# EasyEDA Pro project nrf52840_test_board.epro

# Schematic nrf52840_test_board
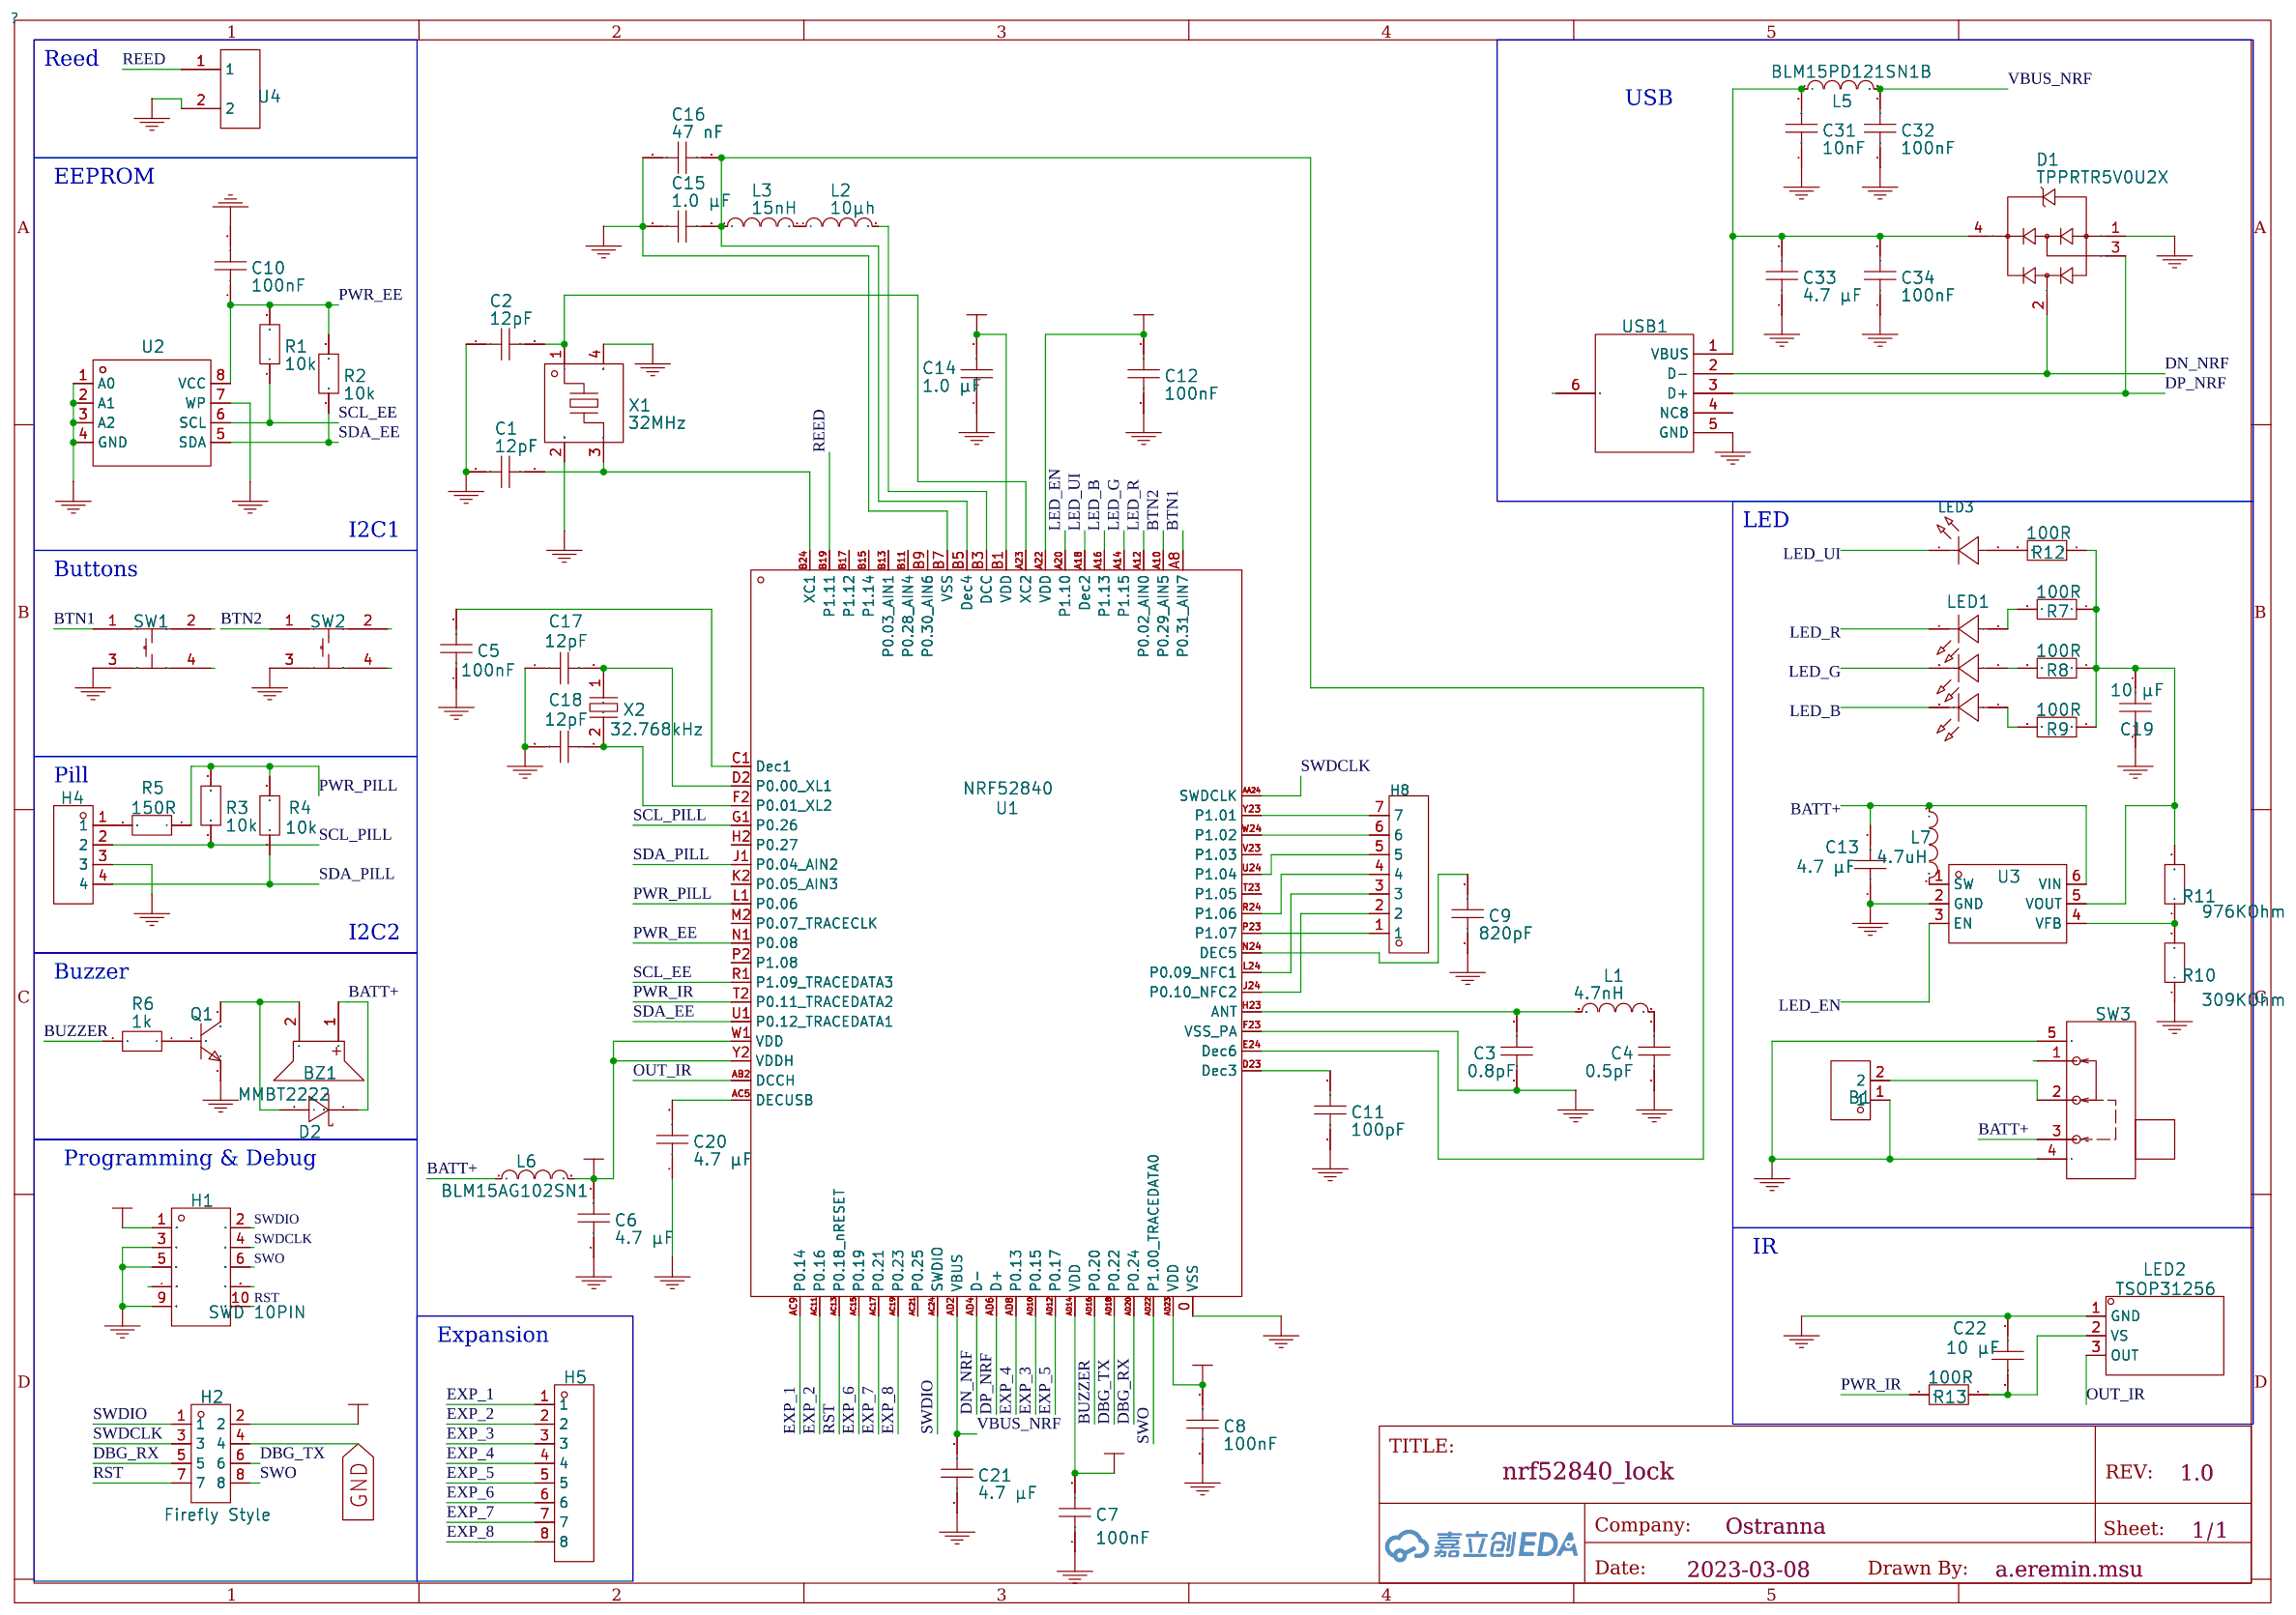
[diagram p0: schematic sheet]

## Parts
B1  MF200V-11-02P  [BAT-TH_2P-P14.50_2462]  (no BOM)
BZ1  QMB-09B-03  [BUZ-TH_BD9.0-P4.00-D0.6-FD]
C1  12pF  [C0402]
C2  12pF  [C0402]
C3  0.8pF  [C0402]
C4  0.5pF  [C0402]
C5  100nF  [C0402]
C6  4.7 µF  [C0603]
C7  100nF  [C0402]
C8  100nF  [C0402]
C9  820pF  [C0402]
C10  100nF  [C0402]
C11  100pF  [C0402]
C12  100nF  [C0402]
C13  4.7 µF  [C0603]
C14  1.0 µF  [C0603]
C15  1.0 µF  [C0603]
C16  47 nF  [C0402]
C17  12pF  [C0402]
C18  12pF  [C0402]
C19  10 µF  [C0603]
C20  4.7 µF  [C0603]
C21  4.7 µF  [C0603]
C22  10 µF  [C0603]
C31  10nF  [C0402]
C32  100nF  [C0402]
C33  4.7 µF  [C0603]
C34  100nF  [C0402]
D1  TPPRTR5V0U2X  [SOT-143_L2.9-W1.3-P1.92-LS2.3-BR]
D2  BAT54WS_C397611  [SOD-323_L1.8-W1.3-LS2.5-RD]
H1  SWD 10PIN  [HDR-SMD_10P-P1.27-V-M-R2-C5-LS5.5]
H2  Firefly Style  [HDR-TH_8P-P2.54-V-M-R2-C4-S2.54]
H4  DW254W-11-04-85  [HDR-TH_4P-P2.54-H-F-W10.3-N]
H5  DW254W-11-08-85  [HDR-TH_8P-P2.54-H-F-W10.3-N]
H8  PZ254R-11-07P  [HDR-TH_7P-P2.54-H-M-W10.4]
L1  4.7nH  [C0402]
L2  10µh  [L0603]
L3  15nH  [C0402]
L5  BLM15PD121SN1B  [L0402]
L6  BLM15AG102SN1  [L0402]
L7  4.7uH  [L0603]
LED1  TC5050RGBF08-3CJH-AF53A  [LED-SMD_6P-L5.0-W5.0-TL_TC5050RGBF08]
LED2  TSOP31256  [SENSOR-TH_TSOP31256]
LED3  LTST-T680TGWT  [LED-SMD_L3.2-W2.8-LS3.5-RD_GREEN]
Q1  MMBT2222  [SOT-23-3_L2.9-W1.4-P1.91-LS2.6-BR]
R1  10k  [R0603]
R2  10k  [R0603]
R3  10k  [R0603]
R4  10k  [R0603]
R5  150R  [R0603]
R6  1k  [R0603]
R7  100R  [R0603]
R8  100R  [R0603]
R9  100R  [R0603]
R10  309KOhm  [R0603]
R11  976KOhm  [R0603]
R12  100R  [R0603]
R13  100R  [R0603]
SW1  TS-1187A-C-D-B  [KEY-SMD_4P-L5.2-W5.2-P3.7-LS6.4-TL]
SW2  TS-1187A-C-D-B  [KEY-SMD_4P-L5.2-W5.2-P3.7-LS6.4-TL]
SW3  SS-12F44-G5_C2998807  [SW-TH_SS-12F44-G5_C2998807]
U1  NRF52840  [AQFN-73_L7.0-W7.0-P0.50-BL-EP4.8-REDUCE-PAD]
U2  BL24C256A-SFRC  [TSSOP-8_L4.4-W3.0-P0.65-LS6.4-BL]
U3  MCP1640CT-I/CHY  [SOT-23-6_L2.9-W1.6-P0.95-LS2.8-BR]
U4  59165-1-S-00-D  [SENSOR-SMD_59165-1-S-00-D]
USB1  U254-051T-4BH83-S1S  [MICRO-USB-SMD_U254-051T-4BH83-S1S]
X1  32MHz  [CRYSTAL-SMD_4P-L2.0-W1.6-BL]
X2  32.768kHz  [CRYSTAL-SMD_L3.2-W1.5]

## Library data of the parts
B1 = MF200V-11-02P: link: https://atta.szlcsc.com/upload/public/pdf/source/20200414/C501331_15EF5154D14F95062AC11A8719FD61A3.pdf; 3DModel: HDR-TH_2P-P2.00-V-F-3; Supplier: LCSC; Supplier Part: C501331; Manufacturer: XFCN(兴飞); JLCPCB Part Class: Extended Part
BZ1 = QMB-09B-03: link: https://item.szlcsc.com/173200.html; 3DModel: BUZ-TH_D9.0-H5.5-P4.0; Supplier: LCSC; Manufacturer: 华能; Supplier Part: C96256; JLCPCB Part Class: Extended Part; Frequency: 2700Hz
C1 C2 C17 C18 = 12pF: link: https://item.szlcsc.com/15869.html; 3DModel: C0402_L1.0-W0.5-H0.5; Supplier Part: C1547; Supplier: LCSC; Manufacturer Part: 0402CG120J500NT; Manufacturer: FH(风华)
C3 = 0.8pF: link: https://item.szlcsc.com/15869.html; 3DModel: C0402_L1.0-W0.5-H0.5; Supplier Part: C88902; Supplier: LCSC; Manufacturer Part: GJM1555C1HR80WB01D; Manufacturer: muRata(村田)
C4 = 0.5pF: link: https://item.szlcsc.com/15869.html; 3DModel: C0402_L1.0-W0.5-H0.5; Supplier Part: C285052; Supplier: LCSC; Manufacturer Part: 0402CG0R5B500NT; Manufacturer: FH(风华)
C5 C7 C8 C10 C12 C32 C34 = 100nF: link: https://item.szlcsc.com/15869.html; 3DModel: C0402_L1.0-W0.5-H0.5; Supplier Part: C71629; Supplier: LCSC; Manufacturer Part: GRM155R71C104KA88D; Manufacturer: muRata(村田)
C6 C13 C20 C21 C33 = 4.7 µF: link: https://item.szlcsc.com/362304.html; 3DModel: C0603_L1.6-W0.8-H0.8; Supplier Part: C71631; Supplier: LCSC; Manufacturer Part: GRM188R60J475KE19D; Manufacturer: muRata(村田)
C9 = 820pF: link: https://item.szlcsc.com/15869.html; 3DModel: C0402_L1.0-W0.5-H0.5; Supplier Part: C161159; Supplier: LCSC; Manufacturer Part: GCM1555C1H821JA16D; Manufacturer: muRata(村田)
C11 = 100pF: link: https://item.szlcsc.com/15869.html; 3DModel: C0402_L1.0-W0.5-H0.5; Supplier Part: C126492; Supplier: LCSC; Manufacturer Part: GCM1555C1H101JA16D; Manufacturer: muRata(村田)
C14 C15 = 1.0 µF: link: https://item.szlcsc.com/362304.html; 3DModel: C0603_L1.6-W0.8-H0.8; Supplier Part: C15849; Supplier: LCSC; Manufacturer Part: CL10A105KB8NNNC; Manufacturer: SAMSUNG(三星)
C16 = 47 nF: link: https://item.szlcsc.com/15869.html; 3DModel: C0402_L1.0-W0.5-H0.5; Supplier Part: C314287; Supplier: LCSC; Manufacturer Part: 0402B473K250CT; Manufacturer: Walsin(华新科)
C19 C22 = 10 µF: link: https://item.szlcsc.com/362304.html; 3DModel: C0603_L1.6-W0.8-H0.8; Supplier Part: C15849; Supplier: LCSC; Manufacturer Part: CL10A105KB8NNNC; Manufacturer: SAMSUNG(三星)
C31 = 10nF: link: https://item.szlcsc.com/15869.html; 3DModel: C0402_L1.0-W0.5-H0.5; Supplier Part: C2894320; Supplier: LCSC; Manufacturer Part: 0402B103J160NT; Manufacturer: FH(风华)
D1 = TPPRTR5V0U2X: link: https://item.szlcsc.com/280548.html; 3DModel: SOT-143-4P_L3.0-W1.3-H1.0-LS2.3-P1.70; Supplier: LCSC; Supplier Part: C558444; Manufacturer: TECH PUBLIC(台舟); JLCPCB Part Class: Extended Part
D2 = BAT54WS_C397611: link: https://item.szlcsc.com/295156.html; 3DModel: SOD-323_L1.7-W1.3-H1.1-LS2.5; Supplier: LCSC; Supplier Part: C397611; Manufacturer: AnBon(安邦); Manufacturer Part: BAT54WS; JLCPCB Part Class: Extended Part
H1 = SWD 10PIN: link: https://atta.szlcsc.com/upload/public/pdf/source/20220712/F0350B34ECC1B54ABD62D9C7F0276F32.pdf; Supplier: LCSC; Supplier Part: C4943297; Manufacturer: kinghelm(金航标); Manufacturer Part: KH-1.27PH180-2X5P-L7.2-SMT; JLCPCB Part Class: Extended Part
H2 = Firefly Style: link: https://item.szlcsc.com/502977.html; 3DModel: HDR-TH_8P-P2.54-M-LI-2X4P; Supplier: LCSC; Supplier Part: C2935919; Manufacturer: DEALON(德艺隆); Manufacturer Part: DZ254R-22-08-63; JLCPCB Part Class: Extended Part
H4 = DW254W-11-04-85: link: https://atta.szlcsc.com/upload/public/pdf/source/20211231/3C4D2E6B78ED2773EE45870C43BA2BC5.pdf; Supplier: LCSC; Supplier Part: C2935994; Manufacturer: DEALON(德艺隆); JLCPCB Part Class: Extended Part
H5 = DW254W-11-08-85: link: https://atta.szlcsc.com/upload/public/pdf/source/20211231/3C4D2E6B78ED2773EE45870C43BA2BC5.pdf; Supplier: LCSC; Supplier Part: C2935998; Manufacturer: DEALON(德艺隆); JLCPCB Part Class: Extended Part
H8 = PZ254R-11-07P: Number of Rows:单排 Number of Pins:7 Pitch:2.54mm Pin Structure:1x7P Row Spacing:- Mounting Type:Shrouded Circluar Pins/Square Pins:Square Pins Current Rating (Max):- Voltage Rating (Max):- Length of Mating Pin:6mm Insulation Height:2.5mm Contact Material:; LCSC Part Name: 2.54mm 1x7P 弯插 方针; Supplier Part: C492415; Manufacturer: XFCN(兴飞); Supplier Footprint: 弯插,P=2.54mm; JLCPCB Part Class: Extended Part; Datasheet: https://atta.szlcsc.com/upload/public/pdf/source/20200309/C492415_DA188E9910EB3F381D5A5032EE25D5A2.pdf; Supplier: LCSC; Number of Rows: 单排; Number of Pins: 7; Pitch: 2.54mm; Pin Structure: 1x7P; Mounting Type: Shrouded; Circluar Pins/Square Pins: Square Pins; Length of Mating Pin: 6mm; Insulation Height: 2.5mm; Operating Temperature Range: -40℃~+105℃; Color: Black
L1 = 4.7nH: link: https://item.szlcsc.com/15869.html; 3DModel: C0402_L1.0-W0.5-H0.5; Supplier Part: C23769; Supplier: LCSC; Manufacturer Part: LQP15MN4N7B02D; Manufacturer: muRata(村田)
L2 = 10µh: link: https://item.szlcsc.com/344093.html; 3DModel: L0603_L1.6-W0.8-H0.5_BEAD; Supplier Part: C87216; Supplier: LCSC; Manufacturer Part: LBMF1608T100K; Manufacturer: TAIYO YUDEN(太诱)
L3 = 15nH: link: https://item.szlcsc.com/15869.html; 3DModel: C0402_L1.0-W0.5-H0.5; Supplier Part: C329619; Supplier: LCSC; Manufacturer Part: CS0402-15NH-S; Manufacturer: chilisin(奇力新)
L5 = BLM15PD121SN1B: link: https://item.szlcsc.com/344049.html; 3DModel: L0402_L1.0-W0.5-H0.5_BEAD; Supplier: LCSC; Supplier Part: C76891; Manufacturer: muRata(村田); Manufacturer Part: BLM15PD121SN1D
L6 = BLM15AG102SN1: link: https://item.szlcsc.com/344049.html; 3DModel: L0402_L1.0-W0.5-H0.5_BEAD; Supplier: LCSC; Manufacturer: muRata(村田); Manufacturer Part: BLM15AG102SN1D; Supplier Part: C76883; JLCPCB Part Class: Extended Part
L7 = 4.7uH: link: https://item.szlcsc.com/344093.html; 3DModel: L0603_L1.6-W0.8-H0.5_BEAD; Supplier Part: C295681; Supplier: LCSC; Manufacturer Part: CPY160808T-4R7M-NP; Manufacturer: chilisin(奇力新)
LED1 = TC5050RGBF08-3CJH-AF53A: link: https://item.szlcsc.com/839886.html; Supplier: LCSC; Supplier Part: C784540; Manufacturer: TCWIN(天成); JLCPCB Part Class: Extended Part
LED2 = TSOP31256: Supplier: LCSC; Supplier Part: C222500; Manufacturer: VISHAY(威世); JLCPCB Part Class: Extended Part
LED3 = LTST-T680TGWT: Emitted Color:普绿/Yellow-Green Diode Configuration:- Lens Color:- Dominant Wavelength:520nm~535nm Dominant Wavelength:520nm~535nm Peak Wavelength:523nm Color Temperature:- Color Temperature:- Forward Current:20mA Power Dissipation:80mW Viewing Angle:120° M; LCSC Part Name: 普绿/黄绿 520nm~535nm; Supplier Part: C575517; Manufacturer: LITEON(光宝); Supplier Footprint: 3528(mm); JLCPCB Part Class: Extended Part; Datasheet: https://atta.szlcsc.com/upload/public/pdf/source/20200604/C575517_740B39B6E37E2B158EE3A100F537416B.pdf; Supplier: LCSC; Emitted Color: 普绿/Yellow-Green; Dominant Wavelength: 520nm~535nm; Peak Wavelength: 523nm; Forward Current: 20mA; Power Dissipation: 80mW; Viewing Angle: 120°; Operating Temperature: -40℃~+85℃
Q1 = MMBT2222: link: https://atta.szlcsc.com/upload/public/pdf/source/20210506/C2828457_40A6ADD2242555ADA7F9DD1BF18610A6.pdf; Supplier: LCSC; Supplier Part: C2891810; Manufacturer: YONGYUTAI(永裕泰); JLCPCB Part Class: Extended Part
R1-R4 = 10k: link: https://www.mouser.in/datasheet/2/447/PYu_RT_1_to_0_01_RoHS_L_11-1669912.pdf; Supplier Part: C25804; Supplier: LCSC; Manufacturer Part: 0603WAF1002T5E; Manufacturer: UNI-ROYAL(厚声)
R5 = 150R: link: https://www.mouser.in/datasheet/2/447/PYu_RT_1_to_0_01_RoHS_L_11-1669912.pdf; Supplier Part: C22808; Supplier: LCSC; Manufacturer Part: 0603WAF1500T5E; Manufacturer: UNI-ROYAL(厚声)
R6 = 1k: link: https://www.mouser.in/datasheet/2/447/PYu_RT_1_to_0_01_RoHS_L_11-1669912.pdf; Supplier Part: C21190; Supplier: LCSC; Manufacturer Part: 0603WAF1001T5E; Manufacturer: UNI-ROYAL(厚声)
R7-R9 R12 R13 = 100R: link: https://www.mouser.in/datasheet/2/447/PYu_RT_1_to_0_01_RoHS_L_11-1669912.pdf; Supplier Part: C22775; Supplier: LCSC; Manufacturer Part: 0603WAF1000T5E; Manufacturer: UNI-ROYAL(厚声)
R10 = 309KOhm: link: https://www.mouser.in/datasheet/2/447/PYu_RT_1_to_0_01_RoHS_L_11-1669912.pdf; Supplier Part: C23001; Supplier: LCSC; Manufacturer Part: 0603WAF3093T5E; Manufacturer: UNI-ROYAL(厚声)
R11 = 976KOhm: link: https://www.mouser.in/datasheet/2/447/PYu_RT_1_to_0_01_RoHS_L_11-1669912.pdf; Supplier Part: C177960; Supplier: LCSC; Manufacturer Part: RCT03976KFLF; Manufacturer: HKR
SW1 SW2 = TS-1187A-C-D-B: link: https://item.szlcsc.com/512193.html?ref=editor&logined=true; Supplier: LCSC; Supplier Part: C318888; Manufacturer: XKB Connectivity(中国星坤); JLCPCB Part Class: Extended Part
SW3 = SS-12F44-G5_C2998807: link: https://atta.szlcsc.com/upload/public/pdf/source/20220428/590A0165C728230C4E39516860AD3726.pdf; Supplier: LCSC; Supplier Part: C2998807; Manufacturer: DEALON(德艺隆); Manufacturer Part: SS-12F44-G5; JLCPCB Part Class: Extended Part
U1 = NRF52840: 3DModel: AQFN-73_L7.0-W7.0-H0.9-P0.50; link: https://so.szlcsc.com/global.html?c=&k=C190794; Manufacturer Part: NRF52840-QIAA-R; Supplier: LCSC; Supplier Part: C190794; Manufacturer: NORDIC
U2 = BL24C256A-SFRC: link: https://item.szlcsc.com/42180.html; 3DModel: TSSOP-8_L3.0-W4.4-H1.0-LS6.4-P0.65; Supplier: LCSC; Manufacturer: BL(上海贝岭); Supplier Part: C110276; JLCPCB Part Class: Extended Part
U3 = MCP1640CT-I/CHY: link: https://item.szlcsc.com/169042.html; 3DModel: SOT-23-6_L2.9-W1.6-H1.5-LS2.8-P0.95; Supplier: LCSC; Supplier Part: C511326; Manufacturer: MICROCHIP(美国微芯); JLCPCB Part Class: Extended Part
U4 = 59165-1-S-00-D: link: https://item.szlcsc.com/763200.html; 3DModel: SENSOR-SMD_L16-W2.4-H2.4-59165-1-S-00-D; Supplier: LCSC; Supplier Part: C720178; Manufacturer: Littelfuse(美国力特); JLCPCB Part Class: Extended Part
USB1 = U254-051T-4BH83-S1S: link: https://item.szlcsc.com/300252.html; Supplier: LCSC; Supplier Part: C319160; Manufacturer: XKB Connectivity(中国星坤); JLCPCB Part Class: Extended Part
X1 = 32MHz: link: https://item.szlcsc.com/248817.html; 3DModel: OSC-SMD_4P-L2.0-W1.6-H0.8; Supplier: LCSC; Supplier Part: C2901738; Manufacturer: SCTF(星通时频); Manufacturer Part: SX1B32.000F0810F30; JLCPCB Part Class: Extended Part
X2 = 32.768kHz: link: https://atta.szlcsc.com/upload/public/pdf/source/20171201/C156245_15121213439061157573.pdf; 3DModel: CRYSTAL-SMD_L3.2-W1.5-1; Supplier: LCSC; Supplier Part: C841881; Manufacturer: EPSON(爱普生); Manufacturer Part: Q13FC13500005; JLCPCB Part Class: Extended Part

## Nets
GND: B1.1 C1.2 C2.1 C3.2 C4.2 C5.1 C6.1 C7.1 C8.1 C9.1 C10.2 C11.1 C12.1 C13.1 C14.1 C15.2 C16.2 C17.1 C18.2 C19.2 C20.1 C21.1 C22.1 C31.1 C32.1 C33.1 C34.1 D1.1 H1.3(0) H1.5(0) H1.9(0) H2.4 H4.3 LED2.1(GND) Q1.2(E) R10.1 SW1.3 SW2.3 SW3.4 SW3.5 U1.0(VSS) U1.B7(VSS) U1.F23(VSS_PA) U2.1(A0) U2.2(A1) U2.3(A2) U2.4(GND) U2.7(WP) U3.2(GND) U4.2 USB1.5(GND) X1.2(GND) X1.4(GND)
VBUS_NRF: C21.2 C32.2 L5.2 U1.AD2(VBUS)
VCC: C6.2 C7.2 C8.2 C12.2 C14.2 H1.1(VCC) H2.2 L6.2 U1.A22(VDD) U1.AD14(VDD) U1.AD23(VDD) U1.B1(VDD) U1.W1(VDD) U1.Y2(VDDH)
BATT+: BZ1.1 C13.2 D2.1(C) L6.1 L7.1 SW3.3 U3.6(VIN)
BTN1: SW1.1 U1.A8(P0.31_AIN7)
BTN2: SW2.1 U1.A10(P0.29_AIN5)
BUZZER: R6.2 U1.AD16(P0.20)
DBG_RX: H2.5 U1.AD20(P0.24)
DBG_TX: H2.6 U1.AD18(P0.22)
DN_NRF: D1.2 U1.AD4(D-) USB1.2(D-)
DP_NRF: D1.3 U1.AD6(D+) USB1.3(D+)
EH: USB1.6(EH)
EXP_1: H5.1 U1.AC9(P0.14)
EXP_2: H5.2 U1.AC11(P0.16)
EXP_3: H5.3 U1.AD10(P0.15)
EXP_4: H5.4 U1.AD8(P0.13)
EXP_5: H5.5 U1.AD12(P0.17)
EXP_6: H5.6 U1.AC15(P0.19)
EXP_7: H5.7 U1.AC17(P0.21)
EXP_8: H5.8 U1.AC19(P0.23)
LED_B: LED1.6(-) U1.A16(P1.13)
LED_EN: U1.A20(P1.10) U3.3(EN)
LED_G: LED1.5(-) U1.A14(P1.15)
LED_R: LED1.4(-) U1.A12(P0.02_AIN0)
LED_UI: LED3.1(-) U1.A18(Dec2)
NC1: H1.8(NC1)
NC2: H1.7(NC2)
NC3: SW1.2(NC3)
NC4: SW1.4(NC4)
NC5: SW2.4(NC5)
NC6: SW2.2(NC6)
NC7: SW3.1(NC7)
OUT_IR: LED2.3(OUT) U1.AB2(DCCH)
PWR_EE: C10.1 R1.2 R2.2 U1.N1(P0.08) U2.8(VCC)
PWR_IR: R13.2 U1.T2(P0.11_TRACEDATA2)
PWR_PILL: R3.2 R4.2 R5.1 U1.L1(P0.06)
REED: U1.B19(P1.11) U4.1
RST: H1.10(RST) H2.7 U1.AC13(P0.18_nRESET)
SCL_EE: R1.1 U1.R1(P1.09_TRACEDATA3) U2.6(SCL)
SCL_PILL: H4.2 R3.1 U1.G1(P0.26)
SDA_EE: R2.1 U1.U1(P0.12_TRACEDATA1) U2.5(SDA)
SDA_PILL: H4.4 R4.1 U1.J1(P0.04_AIN2)
SWDCLK: H1.4(CLK) H2.3 U1.AA24(SWDCLK)
SWDIO: H1.2(IO) H2.1 U1.AC24(SWDIO)
SWO: H1.6(SWO) H2.8 U1.AD22(P1.00_TRACEDATA0)
$1N227: C1.1 U1.B24(XC1) X1.3
$1N363: C20.2 U1.AC5(DECUSB)
$1N366: C11.2 U1.D23(Dec3)
$1N371: C2.2 U1.A23(XC2) X1.1
$1N374: C3.1 L1.2 U1.H23(ANT)
$1N375: L2.2 U1.B3(DCC)
$1N434: C9.2 U1.N24(DEC5)
$1N435: H8.7 U1.Y23(P1.01)
$1N436: H8.6 U1.W24(P1.02)
$1N437: H8.1 U1.P23(P1.07)
$1N512: C31.2 C33.2 C34.2 D1.4 L5.1 USB1.1(VBUS)
$1N553: C15.1 C16.1 L3.1 U1.B5(Dec4) U1.E24(Dec6)
$1N611: C5.2 U1.C1(Dec1)
$1N612: C17.2 U1.D2(P0.00_XL1) X2.1
$1N613: C18.1 U1.F2(P0.01_XL2) X2.2(GND)
$1N771: BZ1.2 D2.2(A) Q1.3(C)
$1N826: C19.1 R7.1 R8.1 R9.1 R11.2 R12.1 U3.5(VOUT)
$1N837: LED1.3(+) R7.2
$1N838: LED1.2(+) R8.2
$1N839: LED1.1(+) R9.2
$1N906: R10.2 R11.1 U3.4(VFB)
$1N953: B1.2 SW3.2
$1N1077: H8.2 U1.J24(P0.10_NFC2)
$1N1078: H8.3 U1.L24(P0.09_NFC1)
$1N1079: H8.4 U1.R24(P1.06)
$1N1080: H8.5 U1.U24(P1.04)
$1N1121: C22.2 LED2.2(VS) R13.1
$1N1128: L2.1 L3.2
$1N1133: C4.1 L1.1
$1N1160: H4.1 R5.2
$1N1161: Q1.1(B) R6.1
$1N1164: L7.2 U3.1(SW)
$1N4867: LED3.2(+) R12.2

Not connected (* = marked no-connect by the designer): U1 AC21(P0.25) B9(P0.30_AIN6) B11(P0.28_AIN4) B13(P0.03_AIN1) B15(P1.14) B17(P1.12) H2(P0.27) K2(P0.05_AIN3) M2(P0.07_TRACECLK) P2(P1.08) T23(P1.05) V23(P1.03); USB1 4(NC8)

## Notes on the sheet
- Reed
- USB
- EEPROM
- LED
- I2C1
- Buttons
- Pill
- I2C2
- Buzzer
- Programming & Debug
- IR
- Expansion

# Board 1-PCB_PCB_nrf52840_test_board
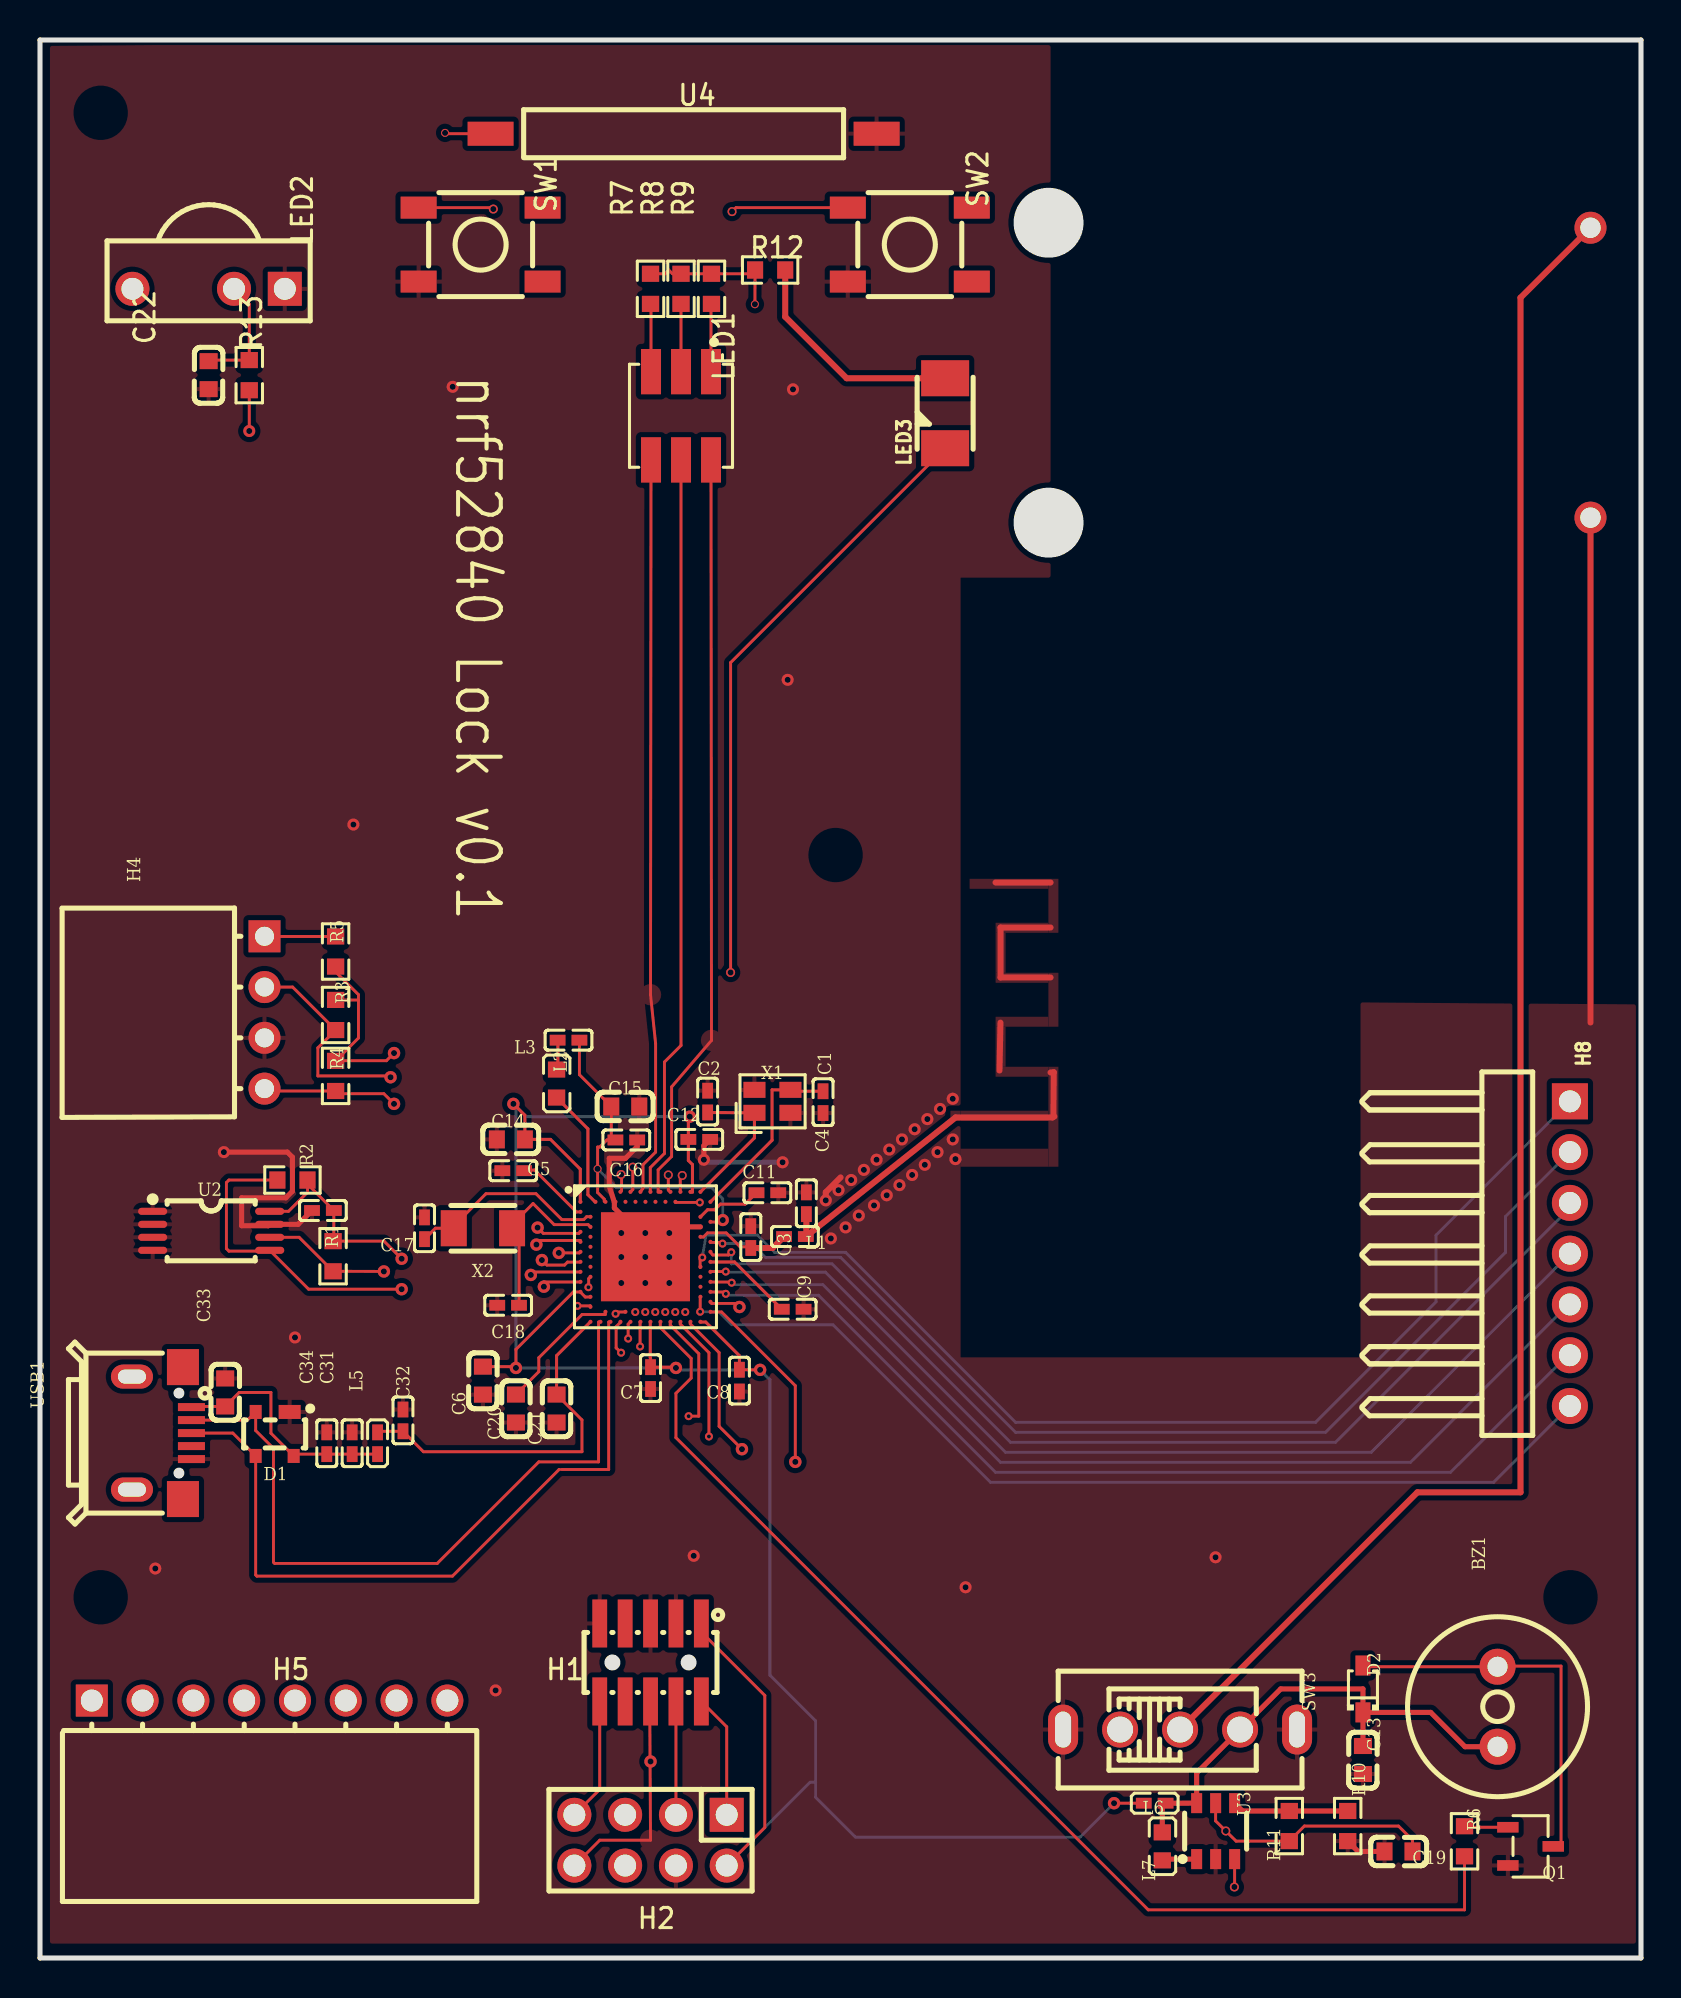
[diagram p1: board, top side]
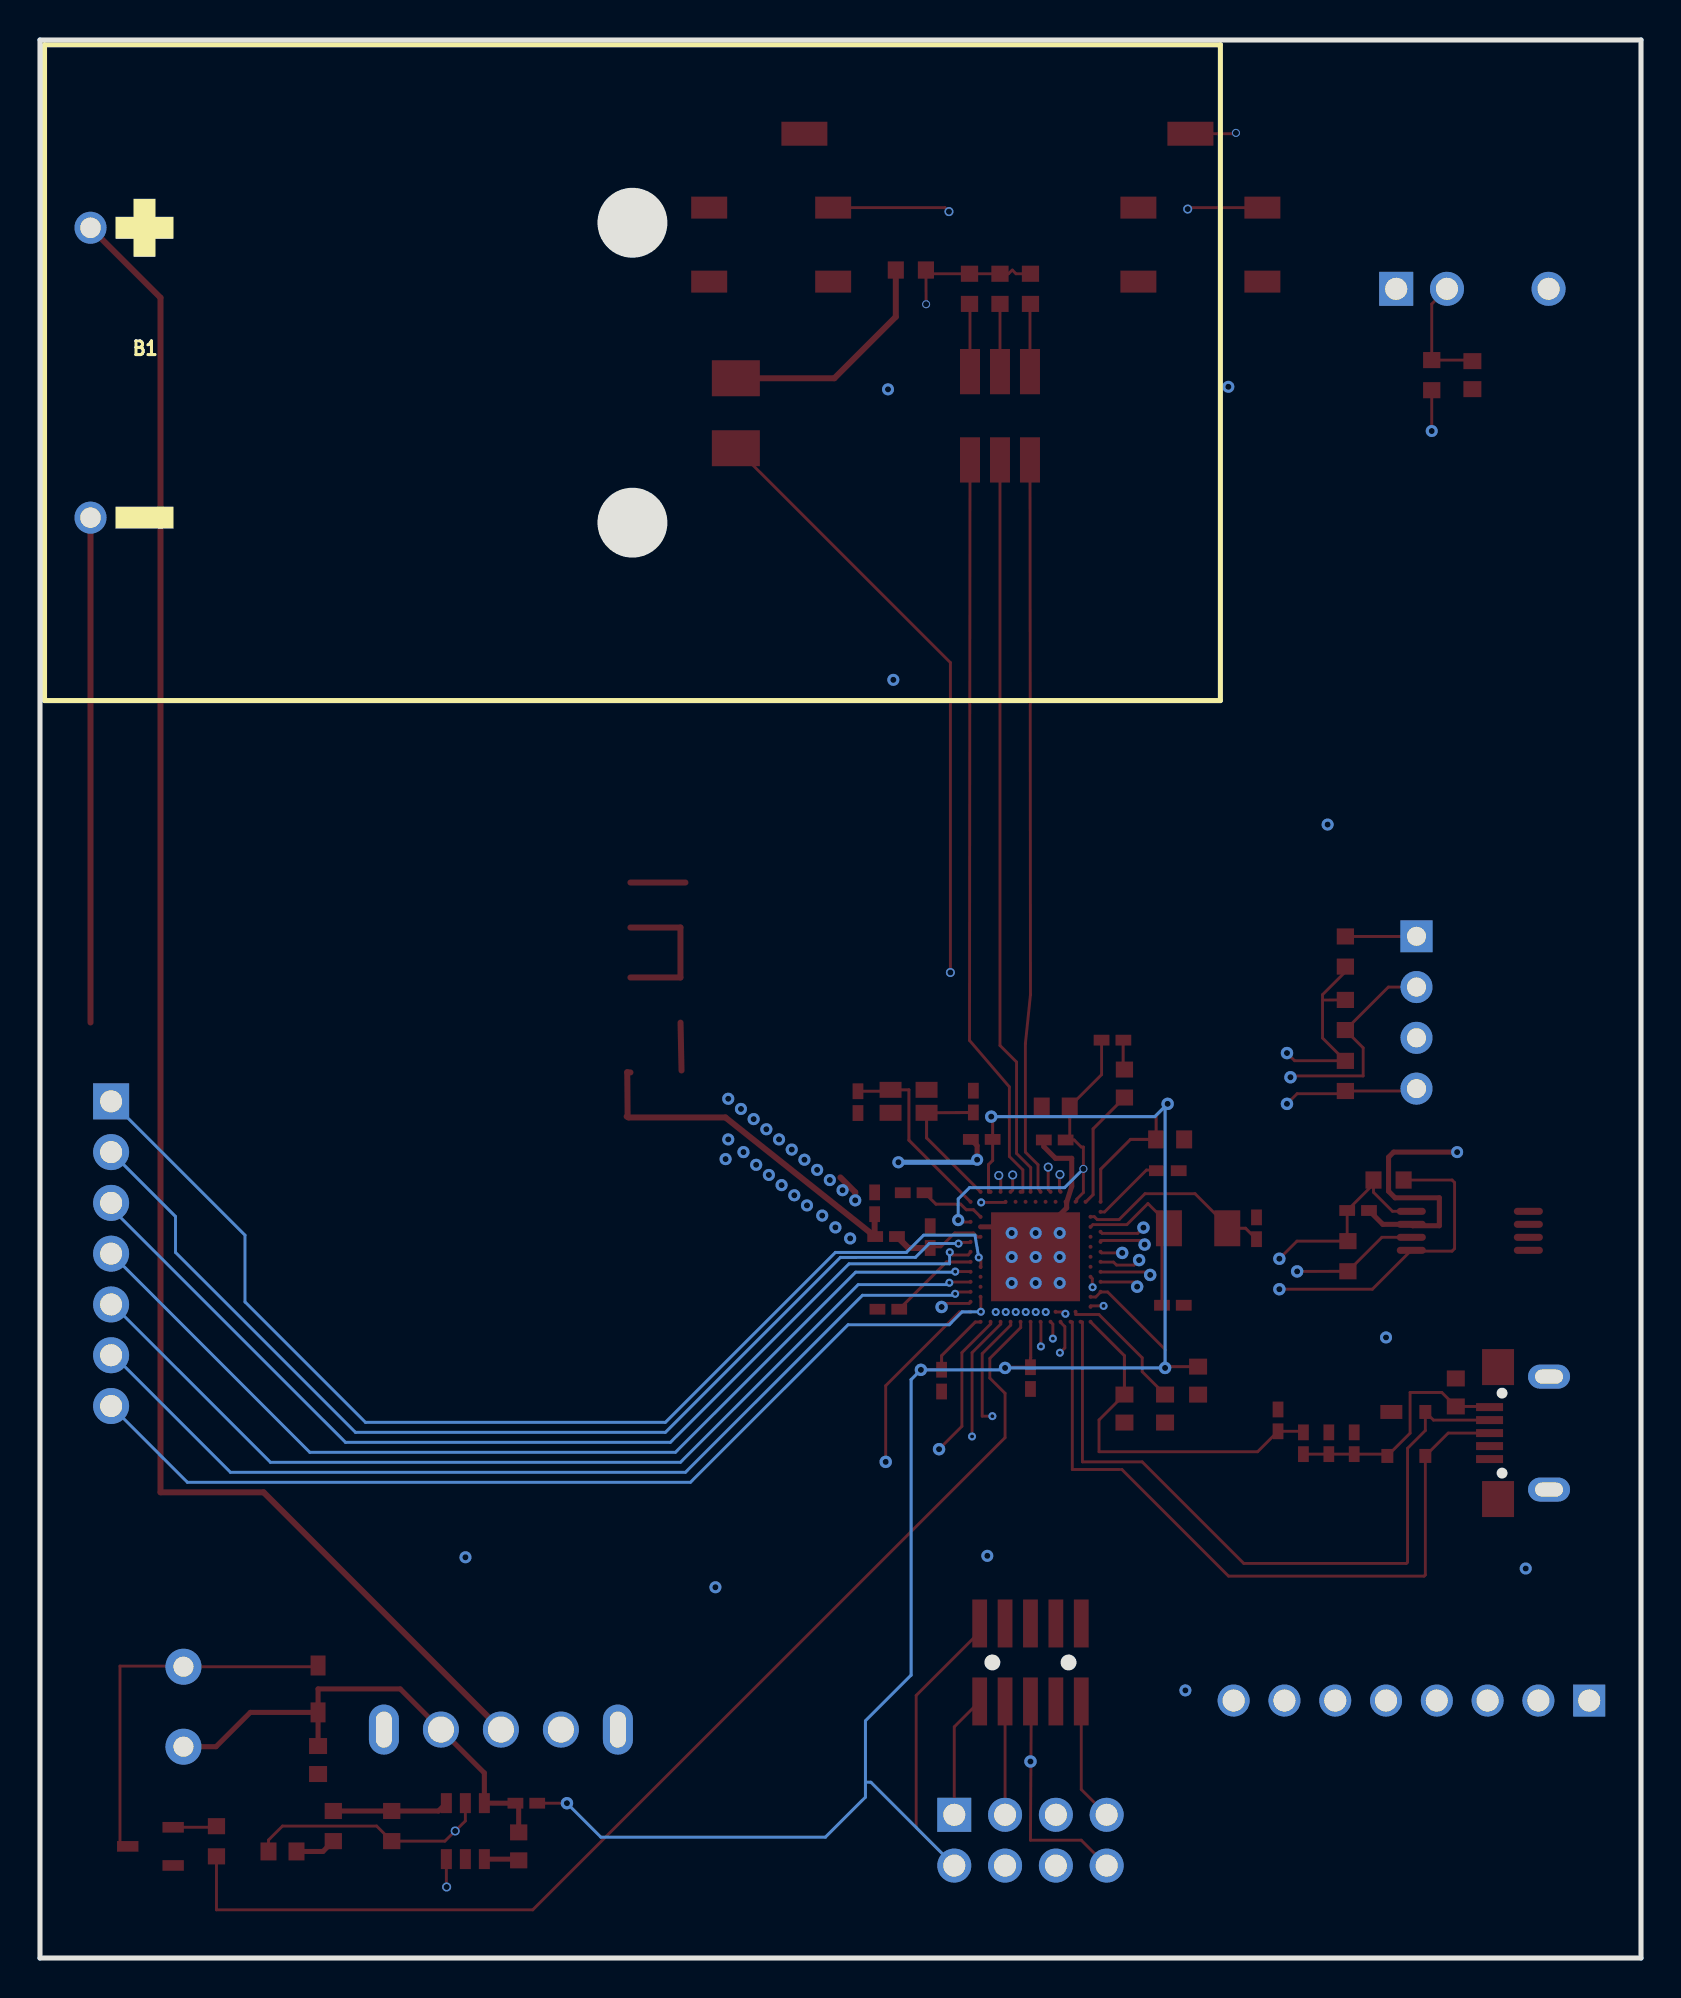
[diagram p2: board, bottom side, seen from below]

Outline 80.06 x 95.94 mm; copper layers: Top Layer, Inner1, Inner2, Bottom Layer. Coordinates in mm from the lower left corner of the outline.
Outline path: 0,95.94 80.06,95.94 80.06,0 0,0 0,95.94
Stack: Top Layer 0.035mm / Dielectric1 0.48mm PP er 4.5 / Inner1 0.035mm / Dielectric2 0.48mm FR4 er 4.5 / Inner2 0.035mm / Dielectric3 0.48mm PP er 4.5 / Bottom Layer 0.035mm

## Design rules (mm)
spacing Default (default): track to track 0.1, other pairs 0 to 0.18
track width Default (default): min 0.145, default 0.145, max 25.4
track width Power: min 0.254, default 0.254, max 25.4
differential pair differentialPair (default): width min 0.127, default 0.254, max 2.54; gap min 0.152, default 0.152
via Default (default): diameter min 0.399, default 0.399, max 0.65; hole min 0.201, default 0.201, max 0.305
via Power: diameter min 0.6, default 0.605, max 0.605; hole min 0.305, default 0.305, max 0.305
net GND uses BottomLayerCopper, Power
net BATT+ uses Power

## Placement (name value [footprint] x y rotation side)
B1  MF200V-11-02P  [BAT-TH_2P-P14.50_2462]  77.53 79.29 0 bottom
BZ1  QMB-09B-03  [BUZ-TH_BD9.0-P4.00-D0.6-FD]  72.89 12.57 90 top
C1  12pF  [C0402]  39.16 42.81 270 top
C2  12pF  [C0402]  33.39 42.84 270 top
C3  0.8pF  [C0402]  35.54 36.06 90 top
C4  0.5pF  [C0402]  38.32 37.75 90 top
C5  100nF  [C0402]  23.66 39.38 0 top
C6  4.7 µF  [C0603]  22.15 28.88 90 top
C7  100nF  [C0402]  30.53 29.01 90 top
C8  100nF  [C0402]  34.98 28.88 90 top
C9  820pF  [C0402]  37.64 32.45 180 top
C10  100nF  [C0402]  14.15 37.39 180 top
C11  100pF  [C0402]  36.37 38.28 180 top
C12  100nF  [C0402]  32.97 40.95 180 top
C13  4.7 µF  [C0603]  66.16 9.9 90 top
C14  1.0 µF  [C0603]  23.55 40.95 0 top
C15  1.0 µF  [C0603]  29.27 42.59 0 top
C16  47 nF  [C0402]  29.32 40.92 0 top
C17  12pF  [C0402]  19.23 36.5 270 top
C18  12pF  [C0402]  23.41 32.65 180 top
C19  10 µF  [C0603]  67.93 5.33 180 top
C20  4.7 µF  [C0603]  23.8 27.48 90 top
C21  4.7 µF  [C0603]  25.83 27.48 90 top
C22  10 µF  [C0603]  8.43 79.17 90 top
C31  10nF  [C0402]  15.61 25.75 270 top
C32  100nF  [C0402]  18.15 26.89 270 top
C33  4.7 µF  [C0603]  9.26 28.29 270 top
C34  100nF  [C0402]  14.34 25.75 270 top
D1  TPPRTR5V0U2X  [SOT-143_L2.9-W1.3-P1.92-LS2.3-BR]  11.73 26.21 90 top
D2  BAT54WS_C397611  [SOD-323_L1.8-W1.3-LS2.5-RD]  66.16 13.46 90 top
H1  SWD 10PIN  [HDR-SMD_10P-P1.27-V-M-R2-C5-LS5.5]  30.53 14.78 180 top
H2  Firefly Style  [HDR-TH_8P-P2.54-V-M-R2-C4-S2.54]  30.53 5.89 180 top
H4  DW254W-11-04-85  [HDR-TH_4P-P2.54-H-F-W10.3-N]  11.23 47.3 270 top
H5  DW254W-11-08-85  [HDR-TH_8P-P2.54-H-F-W10.3-N]  11.48 12.88 0 top
H8  PZ254R-11-07P  [HDR-TH_7P-P2.54-H-M-W10.4]  76.5 35.23 270 top
L1  4.7nH  [C0402]  37.75 36.09 180 top
L2  10µh  [L0603]  25.83 43.74 270 top
L3  15nH  [C0402]  26.43 45.91 180 top
L5  BLM15PD121SN1B  [L0402]  16.88 25.75 90 top
L6  BLM15AG102SN1  [L0402]  55.74 7.74 180 top
L7  4.7uH  [L0603]  56.12 5.58 270 top
LED1  TC5050RGBF08-3CJH-AF53A  [LED-SMD_6P-L5.0-W5.0-TL_TC5050RGBF08]  32.06 77.14 270 top
LED2  TSOP31256  [SENSOR-TH_TSOP31256]  8.43 83.49 180 top
LED3  LTST-T680TGWT  [LED-SMD_L3.2-W2.8-LS3.5-RD_GREEN]  45.26 77.27 90 top
Q1  MMBT2222  [SOT-23-3_L2.9-W1.4-P1.91-LS2.6-BR]  74.54 5.58 180 top
R1  10k  [R0603]  14.66 35.1 90 top
R2  10k  [R0603]  12.62 38.91 0 top
R3  10k  [R0603]  14.78 47.17 90 top
R4  10k  [R0603]  14.78 44.12 90 top
R5  150R  [R0603]  14.78 50.34 90 top
R6  1k  [R0603]  71.24 5.84 270 top
R7  100R  [R0603]  30.53 83.49 270 top
R8  100R  [R0603]  32.06 83.49 270 top
R9  100R  [R0603]  33.58 83.49 270 top
R10  309KOhm  [R0603]  65.39 6.6 90 top
R11  976KOhm  [R0603]  62.47 6.6 270 top
R12  100R  [R0603]  36.51 84.43 0 top
R13  100R  [R0603]  10.46 79.17 270 top
SW1  TS-1187A-C-D-B  [KEY-SMD_4P-L5.2-W5.2-P3.7-LS6.4-TL]  22.03 85.7 0 top
SW2  TS-1187A-C-D-B  [KEY-SMD_4P-L5.2-W5.2-P3.7-LS6.4-TL]  43.5 85.7 0 top
SW3  SS-12F44-G5_C2998807  [SW-TH_SS-12F44-G5_C2998807]  57.01 11.43 0 top
U1  NRF52840  [AQFN-73_L7.0-W7.0-P0.50-BL-EP4.8-REDUCE-PAD]  30.28 35.07 270 top
U2  BL24C256A-SFRC  [TSSOP-8_L4.4-W3.0-P0.65-LS6.4-BL]  8.56 36.37 270 top
U3  MCP1640CT-I/CHY  [SOT-23-6_L2.9-W1.6-P0.95-LS2.8-BR]  58.79 6.35 270 top
U4  59165-1-S-00-D  [SENSOR-SMD_59165-1-S-00-D]  32.19 91.25 0 top
USB1  U254-051T-4BH83-S1S  [MICRO-USB-SMD_U254-051T-4BH83-S1S]  6.09 26.26 270 top
X1  32MHz  [CRYSTAL-SMD_4P-L2.0-W1.6-BL]  36.63 42.85 0 top
X2  32.768kHz  [CRYSTAL-SMD_L3.2-W1.5]  22.15 36.5 0 top

## Footprints (pads in the part's own frame, mm; a bottom-side part is the same pattern mirrored in y, then rotated)
AQFN-73_L7.0-W7.0-P0.50-BL-EP4.8-REDUCE-PAD
  rect 4.45x4.45 smd: 0(0,0)
  round 0.2 smd: A8(-3.25,-1.25) A10(-3.25,-0.75) A12(-3.25,-0.25) A14(-3.25,0.25) A16(-3.25,0.75) A18(-3.25,1.25) A20(-3.25,1.75) A22(-3.25,2.25) A23(-3.25,2.75) AA24(2.25,3.25) AB2(2.5,-2.75) AC5(2.75,-2) AC9(2.75,-1) AC11(2.75,-0.5) AC13(2.75,0) AC15(2.75,0.5) AC17(2.75,1) AC19(2.75,1.5) AC21(2.75,2) AC24(2.75,3.25) AD2(3.25,-2.75) AD4(3.25,-2.25) AD6(3.25,-1.75) AD8(3.25,-1.25) AD10(3.25,-0.75) AD12(3.25,-0.25) AD14(3.25,0.25) AD16(3.25,0.75) AD18(3.25,1.25) AD20(3.25,1.75) AD22(3.25,2.25) AD23(3.25,2.75) B1(-2.75,-3.25) B3(-2.75,-2.5) B5(-2.75,-2) B7(-2.75,-1.5) B9(-2.75,-1) B11(-2.75,-0.5) B13(-2.75,0) B15(-2.75,0.5) B17(-2.75,1) B19(-2.75,1.5) B24(-2.75,3.25) C1(-2.25,-3.25) D2(-2,-2.75) D23(-2,2.75) E24(-1.75,3.25) F2(-1.5,-2.75) F23(-1.5,2.75) G1(-1.25,-3.25) H2(-1,-2.75) H23(-1,2.75) J1(-0.75,-3.25) J24(-0.75,3.25) K2(-0.5,-2.75) L1(-0.25,-3.25) L24(-0.25,3.25) M2(0,-2.75) N1(0.25,-3.25) N24(0.25,3.25) P2(0.5,-2.75) P23(0.5,2.75) R1(0.75,-3.25) R24(0.75,3.25) T2(1,-2.75) T23(1,2.75) U1(1.25,-3.25) U24(1.25,3.25) V23(1.5,2.75) W1(1.75,-3.25) W24(1.75,3.25) Y2(2,-2.75) Y23(2,2.75)
BAT-TH_2P-P14.50_2462
  round 1.6 hole 1.02: 1(0,7.25) 2(0,-7.25)
BUZ-TH_BD9.0-P4.00-D0.6-FD
  round 1.8 hole 1: 1(-2,0) 2(2,0)
C0402
  rect 0.79x0.54 smd: 1(-0.545,0) 2(0.545,0)
C0603
  rect 0.8x0.9 smd: 1(-0.7,0) 2(0.7,0)
CRYSTAL-SMD_4P-L2.0-W1.6-BL
  rect 1.1x0.8 smd: 1(-0.9,-0.575) 2(0.9,-0.575) 3(0.9,0.575) 4(-0.9,0.575)
CRYSTAL-SMD_L3.2-W1.5
  rect 1.3x1.8 smd: 1(-1.458,0) 2(1.458,0)
HDR-SMD_10P-P1.27-V-M-R2-C5-LS5.5
  rect 0.74x2.4 smd: 1(-2.54,-1.95) 2(-2.54,1.95) 3(-1.27,-1.95) 4(-1.27,1.95) 5(0,-1.95) 6(0,1.95) 7(1.27,-1.95) 8(1.27,1.95) 9(2.54,-1.95) 10(2.54,1.95)
HDR-TH_4P-P2.54-H-F-W10.3-N
  rect 1.6x1.6 hole 0.95: 1(-3.81,0)
  round 1.6 hole 0.95: 2(-1.27,0) 3(1.27,0) 4(3.81,0)
HDR-TH_7P-P2.54-H-M-W10.4
  rect 1.8x1.8 hole 1.1: 1(-7.62,0)
  round 1.8 hole 1.1: 2(-5.08,0) 3(-2.54,0) 4(0,0) 5(2.54,0) 6(5.08,0) 7(7.62,0)
HDR-TH_8P-P2.54-H-F-W10.3-N
  rect 1.6x1.6 hole 1.1: 1(-8.89,0)
  round 1.6 hole 1.1: 2(-6.35,0) 3(-3.81,0) 4(-1.27,0) 5(1.27,0) 6(3.81,0) 7(6.35,0) 8(8.89,0)
HDR-TH_8P-P2.54-V-M-R2-C4-S2.54
  rect 1.7x1.7 hole 1.1: 1(-3.81,-1.27)
  round 1.7 hole 1.1: 2(-3.81,1.27) 3(-1.27,-1.27) 4(-1.27,1.27) 5(1.27,-1.27) 6(1.27,1.27) 7(3.81,-1.27) 8(3.81,1.27)
KEY-SMD_4P-L5.2-W5.2-P3.7-LS6.4-TL
  rect 1.8x1.1 smd: 1(-3.1,1.85) 2(3.1,1.85) 3(-3.1,-1.85) 4(3.1,-1.85)
L0402
  rect 0.79x0.54 smd: 1(-0.545,0) 2(0.545,0)
L0603
  rect 0.8x0.864 smd: 1(-0.7,0.001) 2(0.7,0.001)
LED-SMD_6P-L5.0-W5.0-TL_TC5050RGBF08
  rect 2.265x1 smd: 1(-2.208,1.5) 2(-2.208,0) 3(-2.208,-1.5) 4(2.208,-1.5) 5(2.208,0) 6(2.208,1.5)
LED-SMD_L3.2-W2.8-LS3.5-RD_GREEN
  rect 1.8x2.4 smd: 1(-1.75,0) 2(1.75,0)
MICRO-USB-SMD_U254-051T-4BH83-S1S
  rect 0.4x1.35 smd: 1(-1.3,1.488) 2(-0.65,1.488) 3(0,1.488) 4(0.65,1.488) 5(1.3,1.488)
  rect 1.8x1.6 smd: 6(3.3,1.062) 7(-3.3,1.062)
  oval 1.2x2.1 hole 0.7x1.4: 8(2.825,-1.488) 9(-2.825,-1.488)
R0603
  rect 0.806x0.864 smd: 1(-0.753,0) 2(0.753,0)
SENSOR-SMD_59165-1-S-00-D
  rect 2.3x1.2 smd: 1(-9.652,0) 2(9.652,0)
SENSOR-TH_TSOP31256
  rect 1.7x1.7 hole 1.1: 1(-3.81,0)
  round 1.7 hole 1.1: 2(-1.27,0) 3(3.81,0)
SOD-323_L1.8-W1.3-LS2.5-RD
  rect 1x0.75 smd: 1(-1.173,0) 2(1.173,0)
SOT-23-3_L2.9-W1.4-P1.91-LS2.6-BR
  rect 1.07x0.532 smd: 1(1.135,-0.955) 2(1.135,0.955) 3(-1.135,0)
SOT-23-6_L2.9-W1.6-P0.95-LS2.8-BR
  rect 1x0.55 smd: 1(1.4,-0.95) 2(1.4,0) 3(1.4,0.95) 4(-1.4,0.95) 5(-1.4,0) 6(-1.4,-0.95)
SOT-143_L2.9-W1.3-P1.92-LS2.3-BR
  rect 0.7x1.1 smd: 1(1.1,-0.75)
  rect 0.7x0.6 smd: 2(1.1,0.95) 3(-1.1,0.95) 4(-1.1,-0.95)
SW-TH_SS-12F44-G5_C2998807
  round 1.8 hole 1.3: 1(-3,0) 2(0,0) 3(3,0)
  oval 1.5x2.5 hole 0.8x1.8: 4(5.85,0) 5(-5.85,0)
TSSOP-8_L4.4-W3.0-P0.65-LS6.4-BL
  oval 0.353x1.454 smd: 1(-0.975,-2.927) 2(-0.325,-2.927) 3(0.325,-2.927) 4(0.975,-2.927) 5(0.975,2.927) 6(0.325,2.927) 7(-0.325,2.927) 8(-0.975,2.927)

## Nets
As in the schematic.

Pads without a net: U1 AC21 B9 B11 B13 B15 B17 H2 K2 M2 P2 T23 V23; USB1 4 7 8 9

## Via types
v1: diameter 0.4, hole 0.2, Top Layer to Bottom Layer, 22 vias
v2: diameter 0.605, hole 0.305, Top Layer to Bottom Layer, 24 vias
v3: diameter 0.6, hole 0.305, Top Layer to Bottom Layer, 21 vias
v4: diameter 0.62, hole 0.305, Top Layer to Bottom Layer, 22 vias
v5: diameter 0.4, hole 0.305, Top Layer to Bottom Layer, 3 vias
v6: diameter 0.45, hole 0.305, Top Layer to Bottom Layer, 9 vias
v7: diameter 0.61, hole 0.305, Top Layer to Bottom Layer, 1 via

## Routing (per net, layer and track width the routed paths; a pad name or vN(x,y) marks a point on that pad's centre or on a via; arc(x,y) is an arc through that point)
GND: length 53.9
  Top Layer w0.254: v3(9.19,40.31) 12.37,40.31 12.62,40.06 12.62,38.35 12.3,38.02 10.08,38.02 10.08,36.63 11.41,36.63 U2.7 12.91,36.7 C10.2 ; C12.1 33.2,40.63 v2(33.2,39.93) ; 29.86,40.92 29.86,40.58 29.28,40 28.47,40 28.47,38.6 28.72,37.8 28.72,37.52 29.07,37.17 v3(29.07,36.26) ; C19.2 65.91,5.33 R10.1 ; 33.02,36.57 32.1,36.57 32.06,36.61
  Top Layer w0.3: 40.03,39.04 39.29,38.3 v2(39.29,37.9) ; B1.1 77.53,46.79
  Bottom Layer w0.254: v2(37.13,39.8) 33.33,39.8 v2(33.2,39.93)
  vias: v2(39.55,35.99) v2(39.93,38.41) v2(40.28,36.54) v2(40.56,38.91) v2(40.94,37.14) v2(41.2,39.42) v2(41.71,37.64) v2(41.83,39.93) v2(42.34,38.15) v2(42.47,40.44) v2(42.98,38.66) v2(43.1,40.95) v2(43.61,39.17) v2(43.74,41.45) v2(44.25,39.68) v2(44.37,41.96) v2(44.88,40.31) v2(45.01,42.47) v2(45.64,42.98) v2(45.64,40.95) v2(45.78,39.96) v3(5.77,19.48) v3(12.75,31.04) v3(15.67,56.69) v3(20.64,78.59) v3(22.78,13.39) v3(29.07,35.06) v3(29.07,33.76) v3(30.27,36.26) v3(30.27,35.06) v3(30.27,33.76) v3(31.47,36.26) v3(31.47,35.06) v3(31.47,33.76) v3(32.69,20.12) v3(37.39,63.93) v3(37.66,78.46) v3(46.28,18.54) v3(58.78,20.04)
VBUS_NRF: length 18.4
  Top Layer w0.145: L5.2 16.93,26.35 C32.2 19.17,25.32 27.1,25.32 27.1,26.91 C21.2
  Top Layer w0.152: C21.2 25.83,30.13 27.52,31.81
VCC: length 122.1
  Top Layer w0.145: v4(23.8,29.52) 23.8,30.44 26.67,33.31 27.02,33.31 ; 27.02,33.31 27.27,33.06 27.52,33.06 ; 34.98,29.43 v4(36.01,29.42) ; H1.1 33.07,16.31 36.25,13.13 36.25,6.53 34.34,4.62 ; L6.2 v4(53.71,7.74)
  Top Layer w0.152: v4(23.8,29.52) 23.73,29.58 C6.2 ; v4(23.67,42.72) 24.25,42.15 24.25,40.95 25.53,40.95 27.02,39.46 27.02,37.81 ; 32.52,38.31 32.63,38.31 32.63,39.69 32.42,39.89 C12.2 32.42,42.01 v4(32.49,42.08) ; C8.2 34.98,30.12 33.29,31.81 33.02,31.81 ; 30.52,31.81 30.52,30.02 30.53,30.01 C7.2 31.76,29.55 v4(31.8,29.52)
  Bottom Layer w0.145: 38.78,8.79 38.51,8.79 34.34,4.62 ; 38.78,8.79 38.78,11.86 36.5,14.15 ; 38.78,8.79 38.78,8.04 40.78,6.04 52.01,6.04 v4(53.71,7.74)
  Bottom Layer w0.152: v4(32.49,42.08) 24.31,42.08 v4(23.67,42.72) 23.8,42.6 v4(23.8,29.52) v4(31.8,29.52) 31.9,29.42 v4(36.01,29.42) 36.5,28.93 36.5,14.15
(no net):
  vias: v1(32.27,32.31)
BATT+: length 24.9
  Top Layer w0.254: C13.2 D2.1 ; D2.1 66.16,13.46 62.04,13.46 SW3.3 57.84,9.26 U3.6 L6.1 56.12,7.58 L7.1 ; D2.1 69.54,12.29 71.26,10.57 BZ1.1
BTN1: length 55.6
  Top Layer w0.145: 29.08,39.19 29.08,38.39 29.01,38.32 ; SW1.1 22.6,87.55 v6(22.67,87.48)
  Inner2 w0.145: v6(22.67,87.48) 22.67,45.58 v6(29.06,39.19)
BTN2: length 58.6
  Top Layer w0.145: 29.52,38.31 29.64,38.44 v6(29.64,39.56) ; v6(34.61,87.35) 34.81,87.55 SW2.1
  Inner2 w0.145: v6(34.61,87.35) 31.85,87.35 29.64,85.14 v6(29.64,39.56)
BUZZER: length 58.6
  Top Layer w0.145: 31.02,31.81 31.02,31.53 32.56,29.99 32.56,29.01 31.8,28.25 31.8,26.03 55.42,2.41 71.24,2.41 71.24,5.09
DBG_RX: length 31.5
  Top Layer w0.145: v1(33.45,26.09) 33.45,30.28 32.02,31.71 32.02,31.81
  Inner2 w0.145: H2.5 29.13,7.29 29.13,8.05 28.12,9.07 26.34,9.07 25.07,10.34 25.07,16.56 33.45,24.94 v1(33.45,26.09)
DBG_TX: length 34.3
  Top Layer w0.145: 31.52,31.81 31.52,31.66 32.94,30.23 32.94,27.1 v1(32.44,27.1)
  Inner2 w0.145: v1(32.44,27.1) 32.44,24.56 24.44,16.56 24.44,10.34 26.09,8.69 27.36,8.69 27.99,8.05 27.99,5.89 29.26,4.62
DN_NRF: length 36.7
  Top Layer w0.145: USB1.2 10.38,26.91 D1.2 10.78,26.38 11.67,25.49 11.67,19.8 11.73,19.74 19.86,19.74 24.94,24.82 27.93,24.82 27.93,31.81 28.02,31.81
DP_NRF: length 36.9
  Top Layer w0.145: 28.52,31.81 28.44,31.81 28.44,24.44 26.09,24.44 ; USB1.3 9.64,26.26 D1.3 10.78,19.16 10.85,19.1 20.62,19.1 25.96,24.44 25.99,24.44
EXP_1: length 34.7
  Top Layer w0.145: v1(28.78,32.22) 28.87,32.31 29.27,32.31
  Inner1 w0.145: H5.1 20.5,30.79 27.35,30.79 28.78,32.22
EXP_2: length 33.8
  Inner1 w0.145: 29.77,32.31 27.73,30.28 20.62,30.28 20.62,28.37 H5.2
  vias: v1(29.77,32.31)
EXP_3: length 30.1
  Top Layer w0.145: 29.52,31.81 29.41,31.71 v1(29.41,30.98)
  Inner1 w0.145: H5.3 18.85,24.05 22.02,24.05 28.95,30.98 v1(29.41,30.98)
EXP_4: length 27.9
  Top Layer w0.145: 29.02,31.82 29.02,31.79 28.81,31.58 28.81,30.52 29.07,30.28
  Inner1 w0.145: v1(29.06,30.28) 29.06,30.08 22.28,23.29 20.62,23.29 H5.4
EXP_5: length 26.1
  Top Layer w0.145: v1(30.01,30.59) 30.01,31.8 30.02,31.81
  Inner1 w0.145: v1(30.01,30.59) 30.01,30.14 H5.5
EXP_6: length 25.8
  Inner1 w0.145: H5.6 30.77,28.35 v1(30.77,32.31)
EXP_7: length 25
  Inner1 w0.145: H5.7 31.27,26.31 v1(31.27,32.31)
EXP_8: length 25.3
  Inner1 w0.145: H5.8 20.88,13.39 20.88,14.91 33.2,27.23 33.2,30.15 31.77,31.58 v1(31.77,32.31)
LED_B: length 37.7
  Top Layer w0.145: 31.02,38.31 30.91,38.31 30.91,39.42 31.59,40.09 31.59,43.57 33.58,45.9 LED1.6
LED_EN: length 50.4
  Top Layer w0.145: 32.02,38.31 32.02,39.04 v6(32.12,39.14) ; U3.3 59.74,3.75 59.73,3.73 v6(59.73,3.55)
  Inner2 w0.145: v6(59.73,3.55) 58.28,5 58.28,14.79 34.04,39.04 32.22,39.04 v6(32.12,39.14)
LED_G: length 37.3
  Top Layer w0.145: 30.52,38.31 30.52,39.54 31.23,40.24 31.23,44.82 32.06,45.64 LED1.5
LED_R: length 36.9
  Top Layer w0.145: LED1.4 30.53,48.18 30.78,45.74 30.78,40.31 30.15,39.68 30.16,38.5 30.02,38.31
LED_UI: length 43.1
  Top Layer w0.145: 45.26,75.62 45.26,75.52 34.53,64.79 v6(34.53,49.29) ; 31.52,38.31 31.42,38.41 v6(31.42,39.17)
  Inner2 w0.145: v6(34.53,49.29) 34.53,42.28 v6(31.42,39.17)
OUT_IR: length 75.1
  Top Layer w0.145: 26.88,32.62 27.52,32.62 27.52,32.56
  Inner2 w0.145: 26.88,32.62 26.21,32.62 26.21,32.18 4.37,32.18 4.37,79.17 4.62,79.43 LED2.3
  vias: v1(26.88,32.62)
PWR_EE: length 19.4
  Top Layer w0.145: 14.69,37.39 13.38,38.7 13.38,38.91 13.38,38.3 12.43,37.35 U2.8 ; C10.1 14.69,35.89 R1.2 17.2,35.86 v4(18.08,34.98) ; 25.09,34.92 25.35,34.66 26.23,34.66 26.38,34.81 26.97,34.81
  Inner2 w0.145: v4(18.08,34.98) 25.03,34.98 v4(25.1,34.91)
PWR_IR: length 74.2
  Top Layer w0.145: R13.2 v3(10.47,76.38) ; 27.52,34.06 27.44,33.98 27.44,33.57
  Inner2 w0.145: v3(10.47,76.38) 5.13,76.38 5.13,32.69 25.45,32.69 26.31,33.55 v1(27.42,33.55)
PWR_PILL: length 24.4
  Top Layer w0.145: v4(25.94,35.27) 26.97,35.27 27.02,35.31 ; R3.2 15.93,47.92 ; R4.2 15.93,46.02 15.93,48.18 14.78,49.33 R5.1 ; v4(17.7,45.26) 17.32,44.88 14.78,44.88
  Inner2 w0.145: v4(17.7,45.26) 25.94,37.02 v4(25.94,35.27)
REED: length 68.6
  Top Layer w0.145: v1(33,37.79) 31.79,37.79 31.77,37.81 ; v5(20.26,91.29) 20.3,91.25 U4.1
  Inner2 w0.145: v1(33,37.79) 27.21,37.79 18.21,46.79 18.21,91.29 v5(20.26,91.29)
RST: length 37.6
  Top Layer w0.145: H2.7 27.99,8.43 27.99,12.83
  Inner2 w0.145: v1(30.27,32.31) 30.27,31.43 30.78,30.91 30.78,23.67 23.8,16.69 23.8,7.04 26.59,7.04 H2.7
SCL_EE: length 16.5
  Top Layer w0.145: U2.6 12.96,36.05 R1.1 ; v4(17.2,34.34) 14.66,34.35 ; 27.02,34.31 24.54,34.31 24.54,34.17
  Inner2 w0.145: v4(17.2,34.34) 17.37,34.17 v4(24.54,34.17)
SCL_PILL: length 23.7
  Top Layer w0.145: 27.02,36.31 26.95,36.25 25.17,36.25 v4(24.88,36.53) ; v4(17.53,44.05) 17.53,44.12 13.89,44.12 13.89,45.52 R3.1 12.63,48.57 H4.2
  Inner2 w0.145: v4(24.88,36.53) 17.53,43.88 v4(17.53,44.05)
SDA_EE: length 24.8
  Top Layer w0.145: R2.1 9.45,38.91 9.32,38.79 9.32,35.48 9.45,35.36 11.45,35.36 U2.5 13.43,33.45 v4(18.08,33.45) ; 27.02,33.81 25.2,33.81 v4(25.2,33.58)
  Inner2 w0.145: v4(25.2,33.58) 25.07,33.45 v4(18.08,33.45)
SDA_PILL: length 19.3
  Top Layer w0.145: v4(17.7,42.72) 17.2,43.23 14.92,43.23 R4.1 11.35,43.37 H4.4 ; v4(24.82,35.68) 24.82,35.89 27.02,35.89 27.02,35.81
  Inner2 w0.145: v4(24.82,35.68) 17.78,42.72 v4(17.7,42.72)
SWDCLK: length 37.5
  Top Layer w0.145: v4(34.98,32.56) 34.98,32.74 33.59,32.74 33.52,32.81 ; 31.8,12.83 H2.3
  Inner2 w0.145: v4(34.98,32.56) 35.36,32.56 38.91,29.01 38.91,27.38 35.48,23.95 35.48,13.01 31.8,9.32 H2.3
SWDIO: length 35
  Top Layer w0.145: H2.1 34.34,11.56 33.07,12.83 ; v4(37.77,24.82) 37.77,28.63 34.08,32.31 33.52,32.31
  Inner2 w0.145: H2.1 34.34,10.21 36.5,12.37 36.5,23.8 37.52,24.82 v4(37.77,24.82)
SWO: length 36.2
  Top Layer w0.145: 32.52,31.81 32.52,31.72 33.96,30.28 33.96,26.59 v4(35.1,25.45) ; 26.72,4.62 27.99,5.89 30.53,5.89 30.49,12.79 30.53,12.83
  Inner2 w0.145: v4(30.53,9.83) 30.53,20.88 v4(35.1,25.45)
$1N227: length 9.5
  Top Layer w0.152: 39.16,43.35 37.6,43.35 X1.3 36.61,43.42 36.61,40.9 33.52,37.81
$1N363: length 6.7
  Top Layer w0.145: 28.27,32.31 28.27,32.19 27.11,32.19 24.94,30.02 24.94,29.33 C20.2
$1N366: length 3.3
  Top Layer w0.152: C11.2 35.26,37.71 34.02,37.71 33.74,37.43 33.38,37.43 33.02,37.06
$1N371: length 7.4
  Top Layer w0.152: C2.2 X1.1 35.73,41.02 33.02,38.31
$1N374: length 4.8
  Top Layer w0.145: 33.04,36.06 33.17,36.06 33.38,36.27 34.32,36.27 35.01,35.57 35.54,35.57 C3.1
  Top Layer w0.3: C3.1 36.63,35.51 L1.2
$1N375: length 6
  Top Layer w0.152: 25.83,43.04 27.4,41.47 27.4,38.18 27.77,37.81
$1N434: length 4.6
  Top Layer w0.152: C9.2 34.73,34.81 33.52,34.81
$1N435: length 49.3
  Top Layer w0.145: 33.01,33.03 33.01,32.32
  Bottom Layer w0.145: 33.01,32.32 33.95,32.32 34.59,31.67 39.66,31.67 47.53,23.79 72.69,23.79 H8.7
  vias: v1(33.01,32.33)
$1N436: length 49.2
  Top Layer w0.145: 33.52,33.31 34.21,33.31 v1(34.3,33.22)
  Bottom Layer w0.145: 76.33,30.15 76.39,30.15 ; 76.39,30.15 70.53,24.29 47.78,24.29 38.93,33.15 34.28,33.15 ; 76.39,30.15 H8.6
$1N437: length 57.4
  Top Layer w0.145: v1(33.12,35.04) 33.01,34.94 33.01,34.53
  Bottom Layer w0.145: H8.1 69.81,36.16 69.81,32.82 63.78,26.79 48.78,26.79 40.28,35.29 36.74,35.29 35.87,36.16 33.31,36.16 v1(33.12,35.04)
$1N512: length 12.2
  Top Layer w0.145: 16.88,25.2 12.77,25.2 D1.4 11.55,26.25 11.55,28.29 9.96,28.29 C33.2 7.61,27.59 USB1.1
$1N553: length 18.2
  Top Layer w0.145: 28.21,37.84 28.21,37.96 27.88,38.29 27.88,40.56 27.99,40.56 28.34,40.92 28.77,40.92 ; 33.52,36.81 34.05,36.81 v7(34.14,36.91) ; L3.1 26.97,44.18 C15.1 28.57,41.12 C16.1
  Bottom Layer w0.145: v5(27.88,39.47) 28.82,38.53 33.58,38.53 34.14,37.97 v7(34.14,36.91)
$1N611: length 3.7
  Top Layer w0.145: 27.03,37.32 26.83,37.32 24.73,39.41 24.23,39.4
$1N612: length 9.9
  Top Layer w0.145: 27.54,37.08 27.34,37.08 27.19,36.93 26.1,36.93 24.8,38.23 22.3,38.23 20.62,36.55
  Top Layer w0.152: C17.2 19.77,36.5 X2.1
$1N613: length 8.9
  Top Layer w0.145: 27.54,36.55 27.41,36.68 25.71,36.68 24.66,37.74 23.58,36.67
  Top Layer w0.152: 23.95,32.65 23.95,36.15 X2.2
$1N771: length 19.4
  Top Layer w0.145: Q1.3 76.06,5.58 76.06,14.6 72.92,14.6 BZ1.2 66.22,14.57 D2.2
$1N826: length 135.5
  Top Layer w0.145: R11.2 63.23,6.6 67.93,6.6 68.63,5.9 C19.1 ; 31.43,84.42 31.25,84.24 R7.1 ; v5(35.75,82.72) 35.76,84.43 35.57,84.24 R9.1 31.63,84.24 31.44,84.43 ; 62.47,5.85 59.81,5.85 v6(59.3,6.35) 58.79,6.85 U3.5
  Inner2 w0.3: 35.75,82.72 35.75,82.02 47.31,82.02 48,81.32 48,72.04 37.03,72.04 35.53,70.54 35.53,50.79 37.03,49.29 37.05,49.29 42.53,43.81 42.53,42.54 37.03,37.04 61.53,12.54 61.53,8.59 v6(59.3,6.35)
$1N837: length 3.4
  Top Layer w0.145: LED1.3 30.55,82.71 R7.2
$1N838: length 3.4
  Top Layer w0.145: R8.2 LED1.2
$1N839: length 3.4
  Top Layer w0.145: LED1.1 33.56,82.71 R9.2
$1N906: length 5.8
  Top Layer w0.254: R10.2 R11.1 60.13,7.35 U3.4
$1N953: length 86.6
  Top Layer w0.3: SW3.2 68.88,23.29 74.03,23.29 74.03,83.04 B1.2
$1N1077: length 53.7
  Top Layer w0.145: 33.52,35.79 34.07,35.79 34.12,35.74
  Bottom Layer w0.145: H8.2 73.28,37.09 73.28,35.29 64.28,26.29 48.78,26.29 40.03,35.04 36.28,35.04 35.59,35.74 34.19,35.74
  vias: v1(34.13,35.73)
$1N1078: length 52.4
  Top Layer w0.145: 33.56,35.26 33.64,35.16 34.44,35.16 34.58,35.31
  Bottom Layer w0.145: 34.57,35.28 34.57,34.72 39.61,34.72 48.53,25.79 64.78,25.79 76.5,37.51 H8.3
  vias: v1(34.57,35.3)
$1N1079: length 50.8
  Top Layer w0.145: v1(34.29,34.33) 33.54,34.33 33.52,34.31
  Bottom Layer w0.145: 34.3,34.31 39.27,34.31 48.28,25.29 66.57,25.29 H8.4
$1N1080: length 49.9
  Top Layer w0.145: v1(34.59,33.78) 34.55,33.81 33.52,33.81
  Bottom Layer w0.145: 34.63,33.68 39.15,33.68 48.03,24.79 68.53,24.79 76.43,32.69 H8.5
$1N1121: length 5.9
  Top Layer w0.145: C22.2 8.49,79.93 10.46,79.93 10.46,82.73 LED2.2
$1N1128: length 1.5
  Top Layer w0.152: 25.83,44.44 25.9,44.44 25.9,45.9 L3.2
$1N1133: length 30.7
  Top Layer w0.3: C4.1 38.32,36.11 L1.1 45.78,42.04 50.63,42.04 50.68,42.09 ; 50.53,51.54 48.03,51.54 48.03,49.04 50.53,49.04 ; 50.53,44.29 50.69,44.3 50.68,42.09 ; 47.98,44.39 48.03,46.78 ; 47.78,53.79 50.53,53.79 ; 50.68,42.09 50.72,42.09
$1N1160: length 3.6
  Top Layer w0.145: R5.2 11.24,51.1 H4.1
$1N1161: length 2.2
  Top Layer w0.145: R6.1 71.29,6.54 Q1.1
$1N1164: length 1.7
  Top Layer w0.254: U3.1 56.19,4.95 L7.2
$1N4867: length 11.6
  Top Layer w0.3: LED3.2 40.34,79.02 37.27,82.09 R12.2

## Copper pours and planes (outline as drawn; the poured copper is in the pictures)
GND on Top Layer: 46.03,40.48 50.43,40.48 50.43,39.58 46.03,39.58
GND on Top Layer: 46.03,69.04 46.03,30.04 66.03,30.04 66.03,47.79 80.06,47.7 80.06,0.72 0.5,0.72 0.5,95.64 50.53,96.04 50.53,69.04
GND on Inner1: 46.04,68.96 46.04,29.96 66.04,29.96 66.04,47.71 80.06,47.61 80.07,0.63 0.5,0.63 0.5,95.55 50.54,95.96 50.54,68.96
$1N1133 on Top Layer: 50.43,49.28 50.93,49.28 50.93,46.58 50.43,46.58
$1N1133 on Top Layer: 47.79,44.58 50.43,44.58 50.43,44.08 47.79,44.08
$1N1133 on Top Layer: 47.79,51.78 50.43,51.78 50.43,51.28 47.79,51.28
$1N1133 on Top Layer: 47.79,47.08 50.43,47.08 50.43,46.58 47.79,46.58
$1N1133 on Top Layer: 46.49,53.98 50.43,53.98 50.43,53.48 46.49,53.48
$1N1133 on Top Layer: 46.03,42.38 50.43,42.38 50.43,41.88 46.03,41.88
$1N1133 on Top Layer: 47.79,51.28 48.29,51.28 48.29,49.28 47.79,49.28
$1N1133 on Top Layer: 50.43,44.58 50.93,44.58 50.93,39.58 50.43,39.58
$1N1133 on Top Layer: 47.79,49.28 50.43,49.28 50.43,48.78 47.79,48.78
$1N1133 on Top Layer: 50.43,53.98 50.93,53.98 50.93,51.28 50.43,51.28
$1N1133 on Top Layer: 47.79,46.58 48.29,46.58 48.29,44.58 47.79,44.58

Small or netless copper shapes (teardrops, artwork), in the pictures only: 2 on Top Layer

## Text on the board
Top Silkscreen Layer: nrf52840 Lock v0.1
